# EasyEDA Pro project ProPrj_ESP32C3_UARTLogger_2025-09-07.epro, schematic Schematic2
Board Name: Board2; Create Date: 2025-08-16; Page Name: P1; Project Name: ESP32C3_UARTLogger; Schematic Name: Schematic2; Update Date: 2025-08-24; Company: 嘉立创EDA; Page Size: A4; Version: V1.0
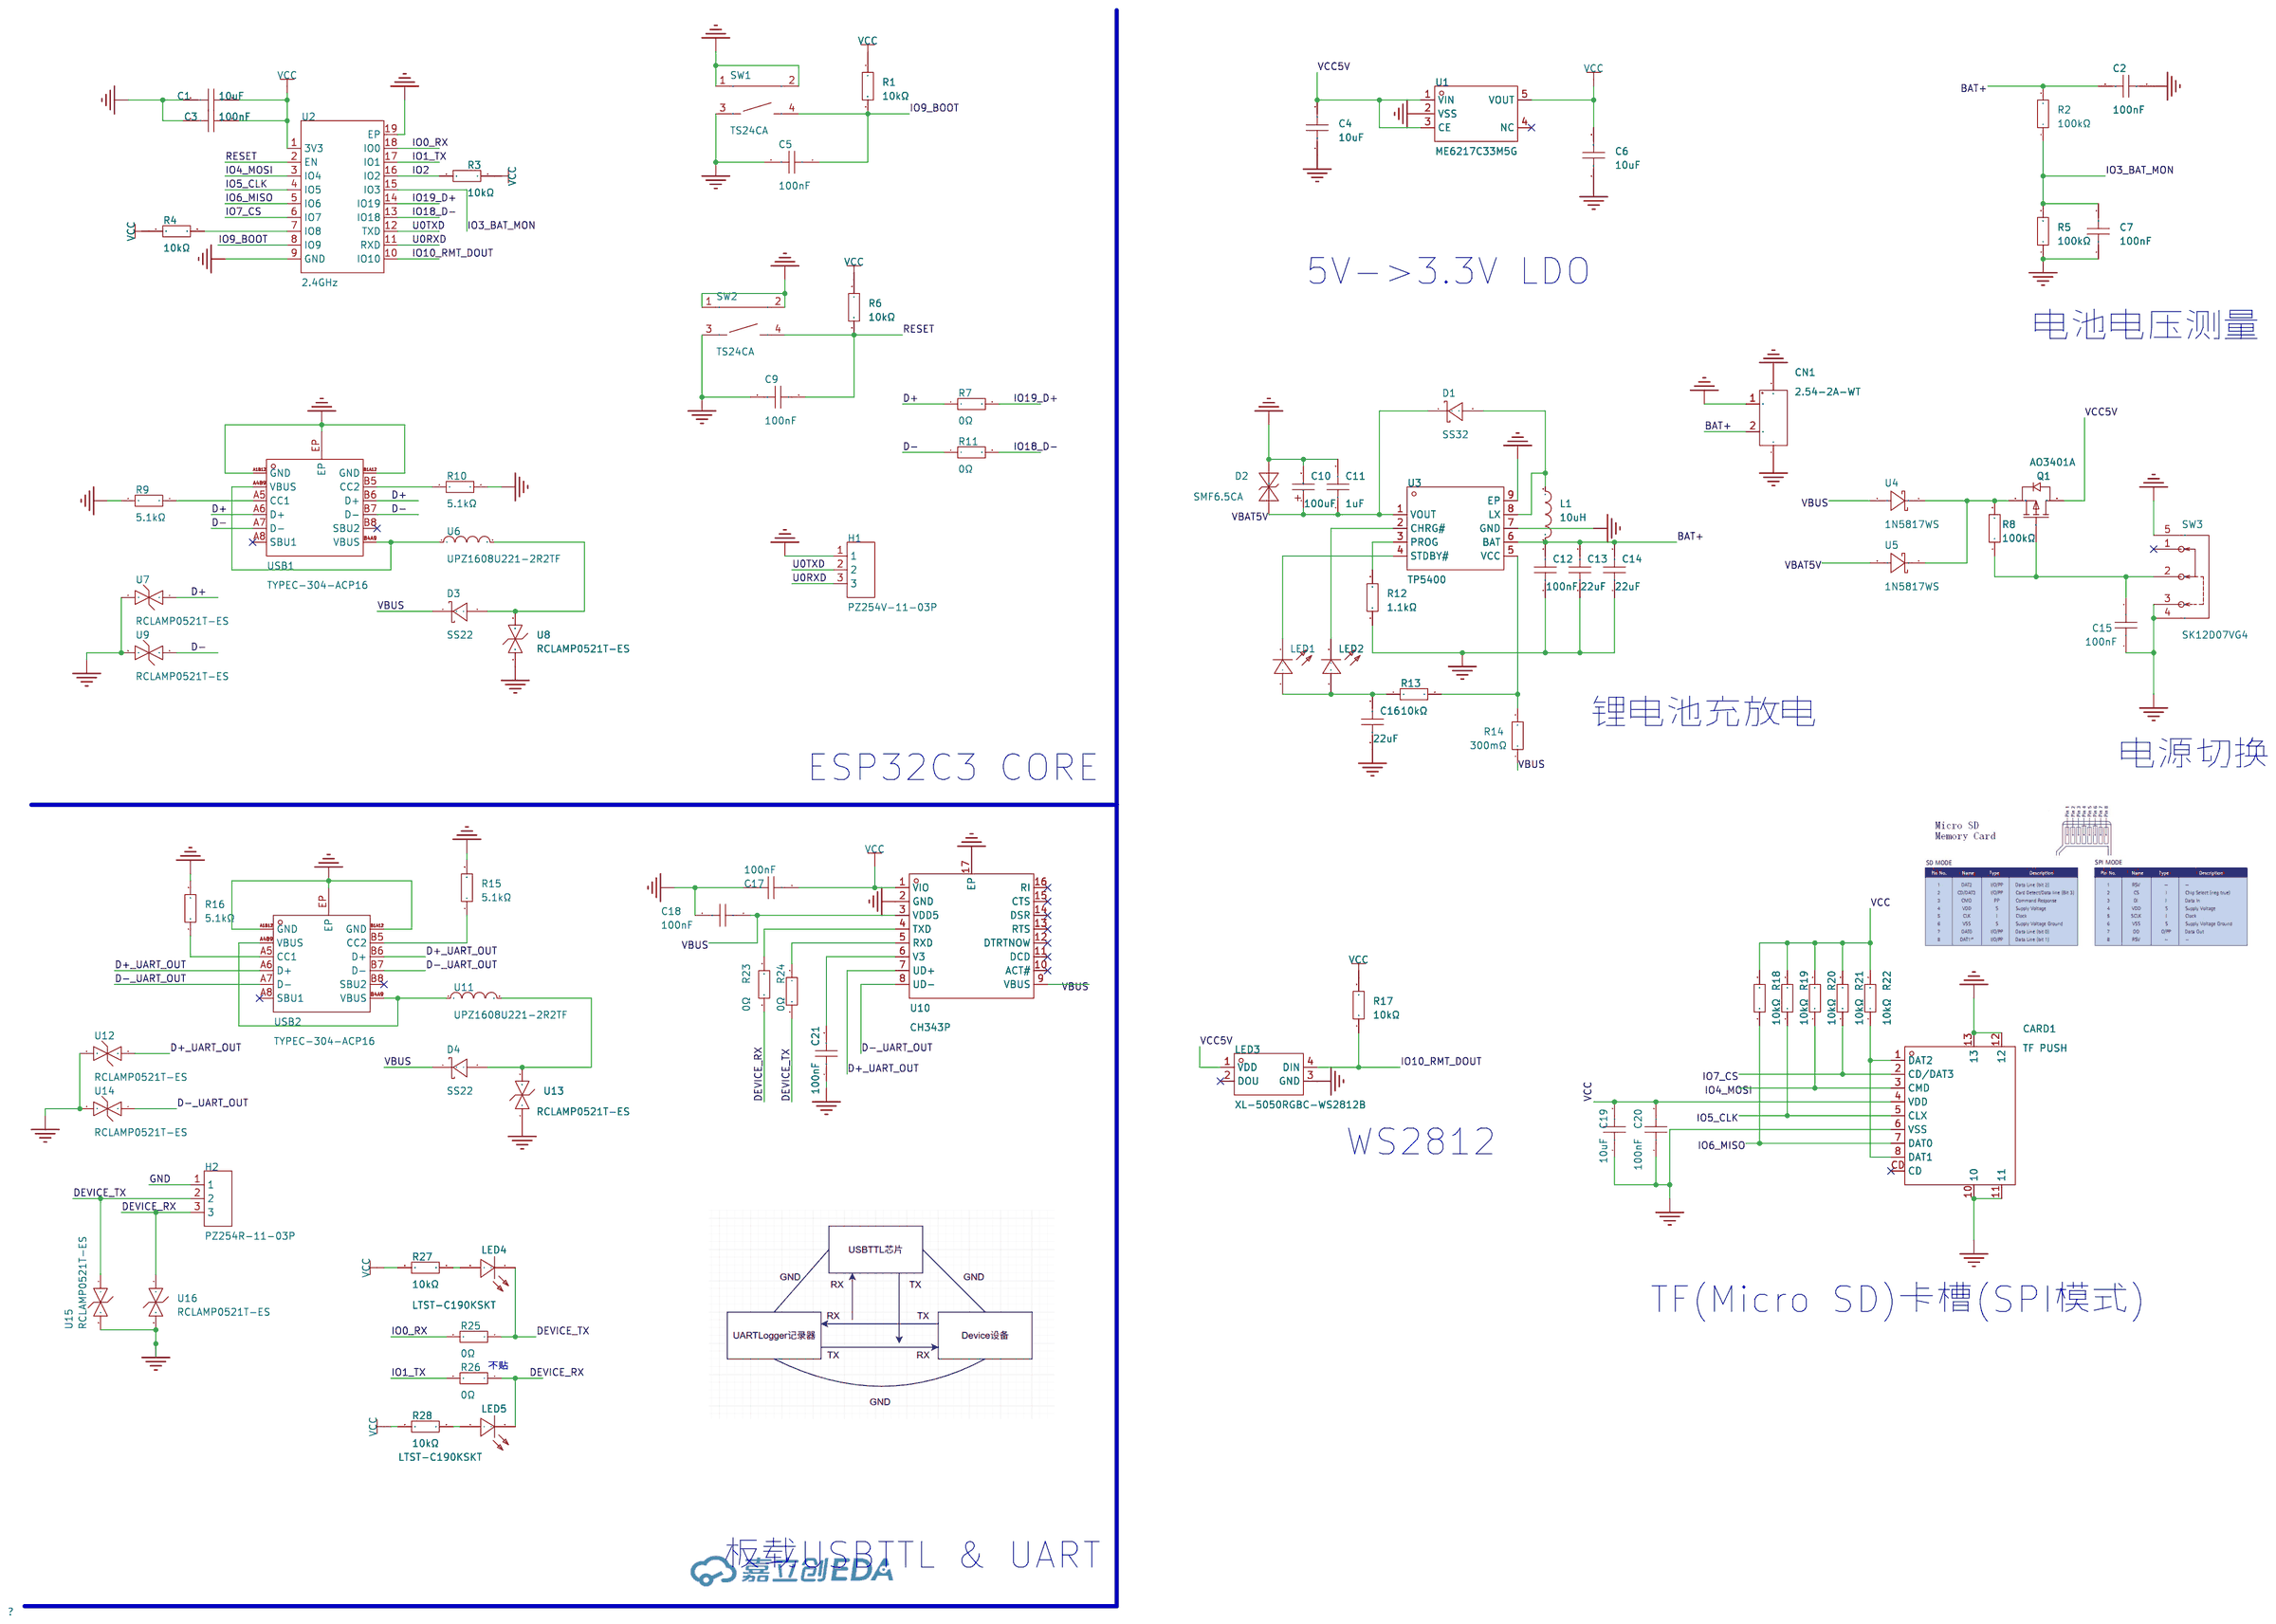
[diagram p1: schematic sheet]

## Parts
C1  10uF  [C0603]
C2  100nF  [C0603]
C3  100nF  [C0603]
C4  10uF  [C0603]
C5  100nF  [C0603]
C6  10uF  [C0603]
C7  100nF  [C0603]
C9  100nF  [C0603]
C10  100uF  [CASE-B_3528]
C11  1uF  [C0603]
C12  100nF  [C0603]
C13  22uF  [C0603]
C14  22uF  [C0603]
C15  100nF  [C0603]
C16  22uF  [C0603]
C17  100nF  [C0603]
C18  100nF  [C0603]
C19  10uF  [C0603]
C20  100nF  [C0603]
C21  100nF  [C0603]
CARD1  TF PUSH  [TF-SMD_TF-PUSH]
CN1  2.54-2A-WT  [CONN-SMD_2.54-2A-WT]
D1  SS32  [SMA_L4.3-W2.6-LS5.2-RD]
D2  SMF6.5CA  [SOD-123FL_L2.7-W1.8-LS3.8-BI]
D3  SS22  [SMA_L4.3-W2.6-LS5.2-RD]
D4  SS22  [SMA_L4.3-W2.6-LS5.2-RD]
H1  PZ254V-11-03P  [HDR-TH_3P-P2.54-V-M]
H2  PZ254R-11-03P  [HDR-TH_3P-P2.54-H-M-W10.4]
L1  10uH  [IND-SMD_L4.4-W4.2]
LED1  MHT192UGCT  [LED0603-RD_GREEN]
LED2  MHT192WDT-ICE  [LED0603-RD]
LED3  XL-5050RGBC-WS2812B  [LED-SMD_4P-L5.0-W5.0-BL_XL-5050RGBC]
LED4  LTST-C190KSKT  [LED0603-RD]
LED5  LTST-C190KSKT  [LED0603-RD]
Q1  AO3401A  [SOT-23_L2.9-W1.3-P1.90-LS2.4-BR]
R1  10kΩ  [R0603]
R2  100kΩ  [R0603]
R3  10kΩ  [R0603]
R4  10kΩ  [R0603]
R5  100kΩ  [R0603]
R6  10kΩ  [R0603]
R7  0Ω  [R0603]
R8  100kΩ  [R0603]
R9  5.1kΩ  [R0603]
R10  5.1kΩ  [R0603]
R11  0Ω  [R0603]
R12  1.1kΩ  [R0603]
R13  10kΩ  [R0603]
R14  300mΩ  [R0603]
R15  5.1kΩ  [R0603]
R16  5.1kΩ  [R0603]
R17  10kΩ  [R0603]
R18  10kΩ  [R0603]
R19  10kΩ  [R0603]
R20  10kΩ  [R0603]
R21  10kΩ  [R0603]
R22  10kΩ  [R0603]
R23  0Ω  [R0603]
R24  0Ω  [R0603]
R25  0Ω  [R0603]
R26  0Ω  [R0603]
R27  10kΩ  [R0603]
R28  10kΩ  [R0603]
SW1  TS24CA  [SW-SMD_TS24CA]
SW2  TS24CA  [SW-SMD_TS24CA]
SW3  SK12D07VG4  [SW-TH_SK12D07VG4]
U1  ME6217C33M5G  [SOT-23-5_L3.0-W1.7-P0.95-LS2.8-BR]
U2  2.4GHz  [BULETM-SMD_ESPRESSIF_ESP32-C3-WROOM-02-N4-4MB]
U3  TP5400  [ESOP-8_L4.9-W3.9-P1.27-LS6.0-BL-EP]
U4  1N5817WS  [SOD-323_L1.7-W1.3-LS2.6-RD-1]
U5  1N5817WS  [SOD-323_L1.7-W1.3-LS2.6-RD-1]
U6  UPZ1608U221-2R2TF  [L0603]
U7  RCLAMP0521T-ES  [DFN1006-2L-BI]
U8  RCLAMP0521T-ES  [DFN1006-2L-BI]
U9  RCLAMP0521T-ES  [DFN1006-2L-BI]
U10  CH343P  [TQFN-16_L3.0-W3.0-P0.50-BL-EP1.7]
U11  UPZ1608U221-2R2TF  [L0603]
U12  RCLAMP0521T-ES  [DFN1006-2L-BI]
U13  RCLAMP0521T-ES  [DFN1006-2L-BI]
U14  RCLAMP0521T-ES  [DFN1006-2L-BI]
U15  RCLAMP0521T-ES  [DFN1006-2L-BI]
U16  RCLAMP0521T-ES  [DFN1006-2L-BI]
USB1  TYPEC-304-ACP16  [USB-C-SMD_TYPE-C-16P-1]
USB2  TYPEC-304-ACP16  [USB-C-SMD_TYPE-C-16P-1]

## Library data of the parts
C1 C4 C6 C19 = CL10A106KP8NNNC: 容值:10uF;精度:±10%;额定电压:10V;材质(温度系数):X5R;; LCSC Part Name: 10uF ±10% 10V; Supplier Part: C19702; Manufacturer: SAMSUNG(三星); Supplier Footprint: 0603; JLCPCB Part Class: 基础库; Datasheet: https://atta.szlcsc.com/upload/public/pdf/source/20160103/1457707703378.pdf; Supplier: LCSC; Tolerance: ±10%; Voltage Rated: 10V; Temperature Coefficient: X5R; Check: true
C2 C7 = CC0603KRX7R9BB104: 容值:100nF;精度:±10%;额定电压:50V;温度系数:X7R;; LCSC Part Name: 100nF ±10% 50V; Supplier Part: C14663; Manufacturer: YAGEO(国巨); Supplier Footprint: 0603; JLCPCB Part Class: Basic Part; Datasheet: https://atta.szlcsc.com/upload/public/pdf/source/20180910/C282072_33301C7F631E79921B82A8DAC6BCC5B3.pdf; Supplier: LCSC; Tolerance: ±10%; Voltage Rated: 50V; Temperature Coefficient: X7R; Voltage Rating: 50V; Check: true
C3 C5 C9 C12 C15 C17 C18 C20 C21 = CC0603KRX7R9BB104: 容值:100nF;精度:±10%;额定电压:50V;材质(温度系数):X7R;; LCSC Part Name: 100nF ±10% 50V; Supplier Part: C14663; Manufacturer: YAGEO(国巨); Supplier Footprint: 0603; JLCPCB Part Class: Basic Part; Datasheet: https://atta.szlcsc.com/upload/public/pdf/source/20180910/C282072_33301C7F631E79921B82A8DAC6BCC5B3.pdf; Supplier: LCSC; Tolerance: ±10%; Voltage Rated: 50V; Temperature Coefficient: X7R; Check: true
C10 = TAJB107M010RNJ: 容值:100uF;精度:±20%;额定电压:10V;等效串联电阻:1.4Ω@100kHz;; LCSC Part Name: 100uF ±20% 10V; Supplier Part: C7196; Manufacturer: Kyocera AVX; Supplier Footprint: CASE-B-3528; JLCPCB Part Class: 扩展库; Datasheet: https://atta.szlcsc.com/upload/public/pdf/source/20160107/1457707750344.pdf; Supplier: LCSC; Tolerance: ±20%; Rated Voltage: 10V; Equivalent Series Resistance(ESR): 1.4Ω@100kHz; Operating Temperature: -55℃~+125℃; Check: true
C11 = CL10A105KB8NNNC: 容值:1uF;精度:±10%;额定电压:50V;材质(温度系数):X5R;; LCSC Part Name: 1uF ±10% 50V; Supplier Part: C15849; Manufacturer: SAMSUNG(三星); Supplier Footprint: 0603; JLCPCB Part Class: 基础库; Datasheet: https://atta.szlcsc.com/upload/public/pdf/source/20160218/1457707763339.pdf; Supplier: LCSC; Tolerance: ±10%; Voltage Rated: 50V; Temperature Coefficient: X5R; Check: true
C13 C14 C16 = CL10A226MQ8NRNC: 容值:22uF;精度:±20%;额定电压:6.3V;材质(温度系数):X5R;; LCSC Part Name: 22uF ±20% 6.3V; Supplier Part: C59461; Manufacturer: SAMSUNG(三星); Supplier Footprint: 0603; JLCPCB Part Class: Basic Part; Datasheet: https://atta.szlcsc.com/upload/public/pdf/source/20160218/1457707763339.pdf; Supplier: LCSC; Tolerance: ±20%; Voltage Rated: 6.3V; Temperature Coefficient: X5R; Check: true
CARD1 = TF PUSH: 卡连接方式:自弹式;卡类型:MicroSD卡(TF卡);连接器类型:卡座;本体最大高度:2mm;工作温度范围:-20℃~+90℃;; LCSC Part Name: 自弹式 MicroSD卡(TF卡) 卡座; Supplier Part: C393941; Manufacturer: SHOU HAN(首韩); Supplier Footprint: SMD; JLCPCB Part Class: 扩展库; Datasheet: https://atta.szlcsc.com/upload/public/pdf/source/20191011/C393941_0DDD896EE907FEB750D8B7B8982E2A67.pdf; Supplier: LCSC; Card Connection Mode: 自弹式; Card Type: MicroSD卡(TF卡); Connector Type: 卡座; Additional Card Detection Pins: 无; Maximum Body Height: 2mm; Operating Temperature Range: -20℃~+90℃; Check: true
CN1 = 2.54-2A-WT: 插针结构:1x2P;间距:2.54mm;安装方式:卧贴;参考系列:XH;总PIN数:2P;排数:1;每排PIN数:2;行距:-;额定电流:500mA;工作温度范围:-25℃~+85℃;; LCSC Part Name: 1x2P 间距:2.54mm 卧贴 系列:XH; Supplier Part: C722696; Manufacturer: CAX(创都); Supplier Footprint: SMD,P=2.54mm,卧贴; JLCPCB Part Class: 扩展库; Datasheet: https://atta.szlcsc.com/upload/public/pdf/source/20200831/C722696_77A3476FAF7CFEE79ECA533977340414.pdf; Supplier: LCSC; Pins Structure: 1x2P; Pitch: 2.54mm; Mounting Style: 卧贴; Reference Series: XH; Number of Pins: 2P; Number of Rows: 1; Number of PINs Per Row: 2; Current Rating (Max): 500mA; Operating Temperature Range: -25℃~+85℃; Check: true
D1 = SS32_C34897: 二极管配置:独立式;正向压降(Vf):550mV@3A;直流反向耐压(Vr):20V;整流电流:3A;; LCSC Part Name: 电压:20V 电流:3A; Supplier Part: C34897; Manufacturer: MDD(辰达半导体); Supplier Footprint: SMA(DO-214AC); JLCPCB Part Class: 扩展库; Datasheet: https://atta.szlcsc.com/upload/public/pdf/source/20230314/A80AE34493C69B89E2F4B1712F433538.pdf; Supplier: LCSC; Diode Configuration: 独立式; Forward Voltage (Vf@If): 550mV@3A; Reverse Voltage (Vr): 20V; Rectified Current: 3A; Reverse Leakage Current (Ir): 500uA@20V; Check: true
D2 = SMF6.5CA_C19077501: 极性:双向;反向截止电压(Vrwm):6.5V;最大钳位电压:11.2V;峰值脉冲电流(Ipp):17.9A;峰值脉冲功率(Ppp):200W;击穿电压:7.22V;; Supplier Part: C19077501; Manufacturer: 宏迦橙; Supplier Footprint: SOD-123FL; JLCPCB Part Class: 扩展库; Datasheet: https://atta.szlcsc.com/upload/public/pdf/source/20241029/BBF9A11676F655A5C9D4546A153AB943.pdf; Supplier: LCSC; polarity: 双向; Reverse Stand-Off Voltage (Vrwm): 6.5V; Maximum Clamping Voltage: 11.2V; Peak Pulse Current (Ipp): 17.9A; Peak Pulse Power Dissipation (Ppp): 200W; Breakdown Voltage: 7.22V; Reverse Leakage Current (Ir): 1uA; Number of Lines: 单路; Operating Temperature: -55℃~+155℃; Type: TVS; Check: true
D3 D4 = SS22_C64989: 二极管配置:独立式;正向压降(Vf):550mV@2A;直流反向耐压(Vr):20V;整流电流:2A;; LCSC Part Name: 电压:20V 电流:2A; Supplier Part: C64989; Manufacturer: MDD(辰达半导体); Supplier Footprint: SMA(DO-214AC); JLCPCB Part Class: 扩展库; Datasheet: https://atta.szlcsc.com/upload/public/pdf/source/20241121/6CE8804B7C48BAEAE01B59A44537D8A1.pdf; Supplier: LCSC; Diode Configuration: 独立式; Forward Voltage (Vf@If): 550mV@2A; Reverse Voltage (Vr): 20V; Rectified Current: 2A; Reverse Leakage Current (Ir): 500uA@20V; Check: true
H1 = PZ254V-11-03P: 插针结构:1x3P;间距:2.54mm;行距:-;圆针/方针:方针;安装方式:直插;排数:单排;总PIN位数:3P;额定电流:3A;额定电压:250V;配合针长度:6mm;塑高:2.5mm;端接针长度:3mm;工作温度:-40℃~+105℃;颜色:黑色;; LCSC Part Name: 1x3P 间距:2.54mm 方针 直插; Supplier Part: C2937625; Manufacturer: XFCN(兴飞); Supplier Footprint: 插件,P=2.54mm; JLCPCB Part Class: 扩展库; Datasheet: https://atta.szlcsc.com/upload/public/pdf/source/20200309/C492402_8335C3D49C4E4C618838D59BB1D024C1.pdf; Supplier: LCSC; Pin Structure: 1x3P; Pitch: 2.54mm; Circluar Pins/Square Pins: 方针; Mounting Type: 直插; Number of Rows: 单排; Number of Pins: 3P; Current Rating: 3A; Voltage Rating (Max): 250V; Length of Mating Pin: 6mm; Insulation Height: 2.5mm; Length of End Connection Pin: 3mm; Operating Temperature: -40℃~+105℃; Color: 黑色
H2 = PZ254R-11-03P: 插针结构:1x3P;间距:2.54mm;行距:-;圆针/方针:方针;安装方式:弯插;排数:单排;总PIN位数:3P;额定电流:-;额定电压:-;配合针长度:6mm;塑高:2.5mm;触头材质:黄铜;触头镀层:-;工作温度:-40℃~+105℃;颜色:黑色;; LCSC Part Name: 1x3P 间距:2.54mm 方针 弯插; Supplier Part: C492411; Manufacturer: XFCN(兴飞); Supplier Footprint: 弯插,P=2.54mm; JLCPCB Part Class: 扩展库; Datasheet: https://atta.szlcsc.com/upload/public/pdf/source/20200309/C492411_5256E8AAA7569F6D33B6ADBFAE4F2888.pdf; Supplier: LCSC; Pin Structure: 1x3P; Pitch: 2.54mm; Circluar Pins/Square Pins: 方针; Mounting Type: 弯插; Number of Rows: 单排; Number of Pins: 3P; Length of Mating Pin: 6mm; Insulation Height: 2.5mm; Contact Material: 黄铜; Operating Temperature: -40℃~+105℃; Color: 黑色; Check: true
L1 = MWSA0402S-100MT: 电感值:10uH;精度:±20%;额定电流:1.6A;饱和电流(Isat):2A;类型:-;; LCSC Part Name: 10uH ±20% 2A; Supplier Part: C408339; Manufacturer: Sunlord(顺络); Supplier Footprint: SMD,4.4x4.2mm; JLCPCB Part Class: 扩展库; Datasheet: https://atta.szlcsc.com/upload/public/pdf/source/20231024/D9DB0CBBB5804BFBC9233D4A02F4216A.pdf; Supplier: LCSC; Tolerance: ±20%; Rated Current: 1.6A; Saturation Current (Isat): 2A; DC Resistance (DCR): 282mΩ; Check: true
LED1 = MHT192UGCT: 发光颜色:翠绿色;功率:60mW;正向电流:20mA;主波长:515nm~530nm;二极管配置:-;透镜颜色:无色透明透镜;色温:-;发光角度:120°;载带方式:-;工作温度:-40℃~+85℃;; LCSC Part Name: 翠绿; Supplier Part: C389519; Manufacturer: MEIHUA(美华); Supplier Footprint: 0603; JLCPCB Part Class: 扩展库; Datasheet: https://atta.szlcsc.com/upload/public/pdf/source/20190515/C389519_7BC27E831414348C8AF19AF18EE4BF58.pdf; Supplier: LCSC; Emitted Color: 翠绿色; Power Dissipation: 60mW; Forward Current: 20mA; Dominant Wavelength: 515nm~530nm; Peak Wavelength: 518nm; Lens Color: 无色透明透镜; Viewing Angle: 120°; Operating Temperature: -40℃~+85℃; Check: true
LED2 = MHT192WDT-ICE: 发光颜色:蓝灯;二极管配置:-;透镜颜色:雾状黄;主波长:-;峰值波长:-;色温:-;光通量(25℃时):-;测试电流:5mA;正向电压(VF):3.1V;发光强度:1420mcd;功率:95mW;发光角度:130°;安装方式:-;工作温度:-35℃~+85℃;; LCSC Part Name: 0603正贴冰蓝色光0.6T 冰蓝; Supplier Part: C389522; Manufacturer: MEIHUA(美华); Supplier Footprint: 0603; JLCPCB Part Class: 扩展库; Datasheet: https://atta.szlcsc.com/upload/public/pdf/source/20190515/C389522_27B43B3FF0A26A72E674F8300763D196.pdf; Supplier: LCSC; Emitted Color: 蓝灯; Lens Color: 雾状黄; Forward Current: 5mA; Forward Voltage (VF): 3.1V; Luminous Intensity: 1420mcd; Power Dissipation: 95mW; Viewing Angle: 130°; Operating Temperature: -35℃~+85℃; Check: true
LED3 = XL-5050RGBC-WS2812B: 5050七彩幻彩透明贴片LED灯珠 5050 幻彩透明四脚 ws2812B 内置驱动IC; Supplier Part: C2843785; Manufacturer: XINGLIGHT(成兴光); Supplier Footprint: SMD5050; JLCPCB Part Class: 扩展库; Datasheet: https://atta.szlcsc.com/upload/public/pdf/source/20240412/E1004CAA80592E31D08BFE019083806F.pdf; Supplier: LCSC; Check: true
LED4 LED5 = LTST-C190KSKT: 发光颜色:黄色;正向电压(VF):2.1V;功率:75mW;正向电流:20mA;主波长:584.5nm~597nm;二极管配置:-;透镜颜色:无色透明透镜;色温:-;发光强度:104mcd;发光角度:130°;载带方式:-;工作温度:-30℃~+85℃;; LCSC Part Name: 黄灯; Supplier Part: C125095; Manufacturer: LITEON(光宝); Supplier Footprint: 0603; JLCPCB Part Class: 扩展库; Datasheet: https://atta.szlcsc.com/upload/public/pdf/source/20180129/C125095_15171881843821315881.pdf; Supplier: LCSC; Emitted Color: 黄色; Forward Voltage (VF): 2.1V; Power Dissipation: 75mW; Forward Current: 20mA; Dominant Wavelength: 584.5nm~597nm; Peak Wavelength: 588nm; Lens Color: 无色透明透镜; Luminous Intensity: 104mcd; Viewing Angle: 130°; Operating Temperature: -30℃~+85℃
Q1 = AO3401A_C347476: 类型:1个P沟道;漏源电压(Vdss):30V;连续漏极电流(Id):4.2A;导通电阻(RDS(on)@Vgs,Id):50mΩ@10V;功率(Pd):1.4W;阈值电压(Vgs(th)@Id):400mV@250uA;; LCSC Part Name: 1个P沟道 耐压:30V 电流:4.2A; Supplier Part: C347476; Manufacturer: UMW(友台半导体); Supplier Footprint: SOT-23; JLCPCB Part Class: Extended Part; Datasheet: https://atta.szlcsc.com/upload/public/pdf/source/20231109/42F312EBB081D72F04A7E8221BFFAF9D.pdf; Supplier: LCSC; Type: 1个P沟道; Drain Source Voltage (Vdss): 30V; Continuous Drain Current (Id): 4.2A; Drain Source On Resistance (RDS(on)@Vgs,Id): 50mΩ@10V; Power Dissipation (Pd): 1.4W; Gate Threshold Voltage (Vgs(th)@Id): 400mV@250uA; Total Gate Charge (Qg@Vgs): 9.4nC@4.5V; Input Capacitance (Ciss@Vds): 954pF; Reverse Transfer Capacitance (Crss@Vds): 77pF; Operating Temperature: -55℃~+150℃; Check: true
R1 R3 R4 R6 R13 R17 R27 R28 = 0603WAF1002T5E: 电阻类型:厚膜电阻;阻值:10kΩ;精度:±1%;功率:100mW;最大工作电压:75V;温度系数:±100ppm/℃;; LCSC Part Name: 厚膜电阻 10kΩ ±1% 100mW; Supplier Part: C25804; Manufacturer: UNI-ROYAL(厚声); Supplier Footprint: 0603; JLCPCB Part Class: Basic Part; Datasheet: https://atta.szlcsc.com/upload/public/pdf/source/20200306/C422600_1E6D84923E4A46A82E41ADD87F860B5C.pdf; Supplier: LCSC; Type: 厚膜电阻; Tolerance: ±1%; Power(Watts): 100mW; Overload Voltage (Max): 75V; Temperature Coefficient: ±100ppm/℃; Operating Temperature Range: -55℃~+155℃; Check: true
R2 R5 R8 = 0603WAF1003T5E: 电阻类型:厚膜电阻;阻值:100kΩ;精度:±1%;功率:100mW;最大工作电压:75V;温度系数:±100ppm/℃;; LCSC Part Name: 100kΩ ±1% 100mW 厚膜电阻; Supplier Part: C25803; Manufacturer: UNI-ROYAL(厚声); Supplier Footprint: 0603; JLCPCB Part Class: 基础库; Datasheet: https://atta.szlcsc.com/upload/public/pdf/source/20200306/C422600_1E6D84923E4A46A82E41ADD87F860B5C.pdf; Supplier: LCSC; Type: 厚膜电阻; Tolerance: ±1%; Power(Watts): 100mW; Overload Voltage (Max): 75V; Temperature Coefficient: ±100ppm/℃; Operating Temperature Range: -55℃~+155℃; Check: true
R7 R11 R23-R26 = 0603WAF0000T5E: 电阻类型:厚膜电阻;阻值:0Ω;精度:±1%;功率:100mW;工作电压:75V;; LCSC Part Name: 0Ω ±1% 100mW 厚膜电阻; Supplier Part: C21189; Manufacturer: UNI-ROYAL(厚声); Supplier Footprint: 0603; JLCPCB Part Class: Basic Part; Datasheet: https://item.szlcsc.com/datasheet/0603WAF0000T5E/21903.html; Supplier: LCSC; Type: 厚膜电阻; Tolerance: ±1%; Power(Watts): 100mW; Voltage-Supply(Max): 75V; Operating Temperature: -55℃~+155℃
R9 R10 R15 R16 = 0603WAF5101T5E: 电阻类型:厚膜电阻;阻值:5.1kΩ;精度:±1%;功率:100mW;最大工作电压:75V;温度系数:±100ppm/℃;; LCSC Part Name: 5.1kΩ ±1% 100mW 厚膜电阻; Supplier Part: C23186; Manufacturer: UNI-ROYAL(厚声); Supplier Footprint: 0603; JLCPCB Part Class: Basic Part; Datasheet: https://atta.szlcsc.com/upload/public/pdf/source/20200306/C422600_1E6D84923E4A46A82E41ADD87F860B5C.pdf; Supplier: LCSC; Type: 厚膜电阻; Tolerance: ±1%; Power(Watts): 100mW; Overload Voltage (Max): 75V; Temperature Coefficient: ±100ppm/℃; Operating Temperature Range: -55℃~+155℃; Check: true
R12 = 0603WAF1101T5E: 电阻类型:厚膜电阻;阻值:1.1kΩ;精度:±1%;功率:100mW;工作电压:75V;温度系数:±100ppm/℃;; LCSC Part Name: 1.1kΩ ±1% 100mW 厚膜电阻; Supplier Part: C22764; Manufacturer: UNI-ROYAL(厚声); Supplier Footprint: 0603; JLCPCB Part Class: 扩展库; Datasheet: https://atta.szlcsc.com/upload/public/pdf/source/20200306/C422600_1E6D84923E4A46A82E41ADD87F860B5C.pdf; Supplier: LCSC; Type: 厚膜电阻; Tolerance: ±1%; Power(Watts): 100mW; Voltage-Supply(Max): 75V; Temperature Coefficient: ±100ppm/℃; Operating Temperature: -55℃~+155℃; Check: true
R14 = 0603WAF300LT5E: 电阻类型:厚膜电阻;阻值:300mΩ;精度:±1%;功率:100mW;最大工作电压:75V;温度系数:±800ppm/℃;; LCSC Part Name: 300mΩ ±1% 100mW 厚膜电阻; Supplier Part: C247136; Manufacturer: UNI-ROYAL(厚声); Supplier Footprint: 0603; JLCPCB Part Class: Extended Part; Datasheet: https://atta.szlcsc.com/upload/public/pdf/source/20200306/C422600_1E6D84923E4A46A82E41ADD87F860B5C.pdf; Supplier: LCSC; Type: 厚膜电阻; Tolerance: ±1%; Power(Watts): 100mW; Overload Voltage (Max): 75V; Temperature Coefficient: ±800ppm/℃; Operating Temperature Range: -55℃~+155℃; Check: true
R18-R22 = RC0603FR-0710KL: 电阻类型:厚膜电阻;阻值:10kΩ;精度:±1%;功率:100mW;最大工作电压:75V;温度系数:±100ppm/℃;; LCSC Part Name: 厚膜电阻 10kΩ ±1% 100mW; Supplier Part: C98220; Manufacturer: YAGEO(国巨); Supplier Footprint: 0603; JLCPCB Part Class: 扩展库; Datasheet: https://atta.szlcsc.com/upload/public/pdf/source/20180927/C295883_E8D83085EA81BD7DE0B2B681138C15EE.pdf; Supplier: LCSC; Type: 厚膜电阻; Tolerance: ±1%; Power(Watts): 100mW; Overload Voltage (Max): 75V; Temperature Coefficient: ±100ppm/℃; Operating Temperature Range: -55℃~+155℃; Check: true
SW1 SW2 = TS24CA: 电路结构:单刀单掷;按钮形状:矩形按钮;安装方式:卧贴;开关长度:4.55mm;开关宽度:1.8mm;开关高度:3.5mm;触点电流:50mA;额定电压:12V;带灯:-;工作寿命:-;; LCSC Part Name: 4.55*1.8*3.5mm 卧贴 轻触开关; Supplier Part: C393942; Manufacturer: SHOU HAN(首韩); Supplier Footprint: SMD; JLCPCB Part Class: 扩展库; Datasheet: https://atta.szlcsc.com/upload/public/pdf/source/20240424/43D93777DD1504A9F6E2A772ABCDC7B4.pdf; Supplier: LCSC; Circuit: 单刀单掷; Actuator Style: 矩形按钮; Mounting Type: 卧贴; Length: 4.55mm; Width: 1.8mm; Switch Height: 3.5mm; Contact Current: 50mA; Voltage Rating: 12V; Check: true
SW3 = SK12D07VG4: 电路结构:单刀双掷;安装方式:-;额定电流(DC):500mA;额定电压(DC):50V;额定电流(AC):-;额定电压(AC):-;机械寿命:5千次;; LCSC Part Name: 3脚2档位 卧插 滑动开关; Supplier Part: C393937; Manufacturer: SHOU HAN(首韩); Supplier Footprint: 插件; JLCPCB Part Class: 扩展库; Datasheet: https://atta.szlcsc.com/upload/public/pdf/source/20190521/C393937_939FE26E571CC67D2D532E953108A1B0.pdf; Supplier: LCSC; Circuit: 单刀双掷; Actuator Style: 矩形柱状; Pin Style: PC引脚; Switch Height: 8.8mm; Current Rating (DC): 500mA; Voltage Rating (DC): 50V; Mechanical Life: 5千次; Check: true
U1 = ME6217C33M5G: 输出类型:固定;最大输入电压:7V;输出电压:3.3V;最大输出电流:800mA;电源纹波抑制比(PSRR):65dB@(1kHz);输出极性:正极;; LCSC Part Name: 输入7V 输出3.3V 800mA; Supplier Part: C427602; Manufacturer: MICRONE(南京微盟); Supplier Footprint: SOT-23-5; JLCPCB Part Class: 扩展库; Datasheet: https://atta.szlcsc.com/upload/public/pdf/source/20190910/C427602_D4B9162A2E9D9EF57C60010DFDECEF37.pdf; Supplier: LCSC; Output Type: 固定; Maximum Input Voltage: 7V; Output Voltage: 3.3V; MAX Output Current: 800mA; Power Supply Rejection Ratio (PSRR): 65dB@(1kHz); Dropout Voltage: 180mV@(300mA); Output Polarity: 正极; Number of Outputs: 1; Check: true
U2 = ESP32-C3-WROOM-02-N4: 核心处理器:ESP32-C3芯片;频率:2.4GHz;发射功率:20.5dBm;; Supplier Part: C2934560; Manufacturer: ESPRESSIF(乐鑫); Supplier Footprint: VFQFN-32-EP; JLCPCB Part Class: 扩展库; Datasheet: https://atta.szlcsc.com/upload/public/pdf/source/20220106/F07459EFFE1D7CBA94B4FB8A075146A6.pdf; Supplier: LCSC; Core Processor: ESP32-C3芯片; Support Interface: I2C；GPIO；SPI；JTAG；UART；USB；I2S; Output Power: 20.5dBm; Check: true
U3 = TP5400: Supplier Part: C2891434; Manufacturer: TOPPOWER(南京拓微); Supplier Footprint: ESOP-8; JLCPCB Part Class: 扩展库; Datasheet: https://atta.szlcsc.com/upload/public/pdf/source/20210909/352D9D40D77A1DD73F7904E364EF004B.pdf; Supplier: LCSC; Check: true
U4 U5 = 1N5817WS_C5190152: 直流反向耐压(Vr):20V;整流电流:1A;; LCSC Part Name: 电压:20V 电流:1A; Supplier Part: C5190152; Manufacturer: Hottech(合科泰); Supplier Footprint: SOD-323; JLCPCB Part Class: 扩展库; Datasheet: https://atta.szlcsc.com/upload/public/pdf/source/20221011/0135DD526E6E216218CEB88C6A2F208C.pdf; Supplier: LCSC; Reverse Voltage (Vr): 20V; Rectified Current: 1A; Check: true
U6 U11 = UPZ1608U221-2R2TF: 标称阻抗@测试频率:220Ω@100MHz;误差:±25%;直流电阻(RDC):50mΩ;; LCSC Part Name: 单路 0603磁珠 阻抗220Ω@100MHz; Supplier Part: C279745; Manufacturer: Sunlord(顺络); Supplier Footprint: 0603; JLCPCB Part Class: 扩展库; Datasheet: https://atta.szlcsc.com/upload/public/pdf/source/20231030/6F67BDFA94A48EA93F9ABB358D1D978C.pdf; Supplier: LCSC; Impedance @ Frequency: 220Ω@100MHz; Tolerance: ±25%; DC Resistance: 50mΩ; Current Rating: 2.2A; Circuits: 1; Check: true
U7-U9 U12-U16 = RCLAMP0521T-ES: 极性:双向;反向截止电压(Vrwm):5V;最大钳位电压:18V;峰值脉冲电流(Ipp):4A;峰值脉冲功率(Ppp):80W;击穿电压:6V;; LCSC Part Name: 0521/0531，单路双向ESD静电防护器件，20kV，CJ：0.25pF；HDMI/USB/NFC/RF超高速接口通讯防护; Supplier Part: C5180263; Manufacturer: ElecSuper(静芯微); Supplier Footprint: DFN1006-2L; JLCPCB Part Class: 扩展库; Datasheet: https://atta.szlcsc.com/upload/public/pdf/source/20240905/E90AFA5EC59D44930BEC0D45A1143918.pdf; Supplier: LCSC; polarity: 双向; Reverse Stand-Off Voltage (Vrwm): 5V; Maximum Clamping Voltage: 18V; Peak Pulse Current (Ipp): 4A; Peak Pulse Power Dissipation (Ppp): 80W; Breakdown Voltage: 6V; Reverse Leakage Current (Ir): 1uA; Number of Lines: 单路; Type: ESD; Check: true
U10 = CH343P: 应用功能:-;接口协议:-;; Supplier Part: C2846043; Manufacturer: WCH(南京沁恒); Supplier Footprint: TQFN-16-EP(3x3); JLCPCB Part Class: 扩展库; Datasheet: https://atta.szlcsc.com/upload/public/pdf/source/20211010/C2846043_7FA705E1F14A2906F6A2AFA45FA28209.pdf; Supplier: LCSC; Check: true
USB1 USB2 = TYPEC-304-ACP16: 连接器类型:Type-C;标准:-;公母:母;端口数量:1;触点数量:16P;安装方式:卧贴;额定电流 - 电源:3A;触头材质:铜;触头镀层:金;工作温度范围:-40℃~+85℃;焊接温度(最大值):-;; LCSC Part Name: Type-C 母 卧贴; Supplier Part: C2982555; Manufacturer: XUNPU(讯普); Supplier Footprint: SMD; JLCPCB Part Class: 扩展库; Datasheet: https://atta.szlcsc.com/upload/public/pdf/source/20220311/3C907F75E12F45E4EE7F73565AB9C294.pdf; Supplier: LCSC; Connector Type: Type-C; Gender: 母; Number of Ports: 1; Number of Contacts: 16P; Mounting Style: 卧贴; Current Rating - Power (Max): 3A; Contact Material: 铜; Contact Plating: 金; Operating Temperature Range: -40℃~+85℃; Check: true

## Nets
GND: C1.1 C2.1 C3.1 C4.1 C5.2 C6.1 C7.1 C9.2 C10.2 C11.2 C12.1 C13.1 C14.1 C15.1 C16.1 C17.2 C18.2 C19.1 C20.1 C21.1 CARD1.6(VSS) CARD1.10 CARD1.11 CARD1.12 CARD1.13 CN1.1 CN1.3 CN1.4 D2.1 H1.1 H2.1 LED3.3(GND) R5.1 R9.2 R10.2 R12.1 R15.2 R16.2 SW1.1 SW1.2 SW1.3 SW2.1 SW2.2 SW2.3 SW3.3 SW3.4 SW3.5 U1.2(VSS) U2.9(GND) U2.19(EP) U3.7(GND) U3.9(EP) U7.2 U8.1 U9.2 U10.2(GND) U10.17(EP) U12.2 U13.1 U14.2 U15.2 U16.2 USB1.A1B12(GND) USB1.B1A12(GND) USB1.EP USB2.A1B12(GND) USB2.B1A12(GND) USB2.EP
VBAT5V: C10.1 C11.1 D1.1(K) D2.2 U3.1(VOUT) U5.2(A)
VBUS: C18.1 D3.1(K) D4.1(K) R14.1 U4.2(A) U10.3(VDD5) U10.9(VBUS)
VCC: C1.2 C3.2 C6.2 C17.1 C19.2 C20.2 CARD1.4(VDD) R1.1 R3.1 R4.1 R6.1 R17.2 R18.2 R19.2 R20.2 R21.2 R22.2 R27.1 R28.1 U1.5(VOUT) U2.1(3V3) U10.1(VIO)
VCC5V: C4.2 LED3.1(VDD) Q1.3(D) U1.1(VIN) U1.3(CE)
BAT+: C2.2 C12.2 C13.2 C14.2 CN1.2 L1.2 R2.2 U3.6(BAT)
D+: R7.1 U7.1 USB1.A6(D+) USB1.B6(D+)
D+_UART_OUT: U10.7(UD+) U12.1 USB2.A6(D+) USB2.B6(D+)
D-: R11.1 U9.1 USB1.A7(D-) USB1.B7(D-)
D-_UART_OUT: U10.8(UD-) U14.1 USB2.A7(D-) USB2.B7(D-)
DEVICE_RX: H2.3 LED5.1(-) R23.2 R26.1 U16.1
DEVICE_TX: H2.2 LED4.1(-) R24.2 R25.1 U15.1
IO0_RX: R25.2 U2.18(IO0)
IO1_TX: R26.2 U2.17(IO1)
IO2: R3.2 U2.16(IO2)
IO3_BAT_MON: C7.2 R2.1 R5.2 U2.15(IO3)
IO4_MOSI: CARD1.3(CMD) R20.1 U2.3(IO4)
IO5_CLK: CARD1.5(CLX) R19.1 U2.4(IO5)
IO6_MISO: CARD1.7(DAT0) R18.1 U2.5(IO6)
IO7_CS: CARD1.2(CD/DAT3) R21.1 U2.6(IO7)
IO9_BOOT: C5.1 R1.2 SW1.4 U2.8(IO9)
IO10_RMT_DOUT: LED3.4(DIN) R17.1 U2.10(IO10)
IO18_D-: R11.2 U2.13(IO18)
IO19_D+: R7.2 U2.14(IO19)
RESET: C9.1 R6.2 SW2.4 U2.2(EN)
U0RXD: H1.3 U2.11(RXD)
U0TXD: H1.2 U2.12(TXD)
$1N1037: R4.2 U2.7(IO8)
$1N2849: R10.1 USB1.B5(CC2)
$1N2855: U6.1 USB1.A4B9(VBUS) USB1.B4A9(VBUS)
$1N2861: R9.1 USB1.A5(CC1)
$1N3712: C21.2 U10.6(V3)
$1N4143: U11.1 USB2.A4B9(VBUS) USB2.B4A9(VBUS)
$1N4164: R16.1 USB2.A5(CC1)
$1N5573: R15.1 USB2.B5(CC2)
$1N5644: D4.2(A) U11.2 U13.2
$1N5686: D3.2(A) U6.2 U8.2
$1N9313: D1.2(A) L1.1 U3.8(LX)
$1N9314: R12.2 U3.3(PROG)
$1N9315: LED1.1(-) U3.4(STDBY#)
$1N9316: LED2.1(-) U3.2(CHRG#)
$1N9317: R13.2 R14.2 U3.5(VCC)
$1N9320: C16.2 LED1.2(+) LED2.2(+) R13.1
$1N9326: Q1.2(S) R8.2 U4.1(C) U5.1(C)
$1N9327: C15.2 Q1.1(G) R8.1 SW3.2
$1N15856: CARD1.1(DAT2) CARD1.8(DAT1) R22.1
$1N37074: R23.1 U10.4(TXD)
$1N37118: R24.1 U10.5(RXD)
$1N56887: LED4.2(+) R27.2
$1N56895: LED5.2(+) R28.2

Not connected (* = marked no-connect by the designer): CARD1 CD*; LED3 2(DOU)*; SW3 1*; U1 4(NC)*; U10 10(ACT#)* 11(DCD)* 12(DTRTNOW)* 13(RTS)* 14(DSR)* 15(CTS)* 16(RI)*; USB1 A8(SBU1)* B8(SBU2)*; USB2 A8(SBU1)* B8(SBU2)*

## Notes on the sheet
- 5V->3.3V LDO
- 电池电压测量
- 锂电池充放电
- 电源切换
- ESP32C3 CORE
- WS2812
- TF(Micro SD)卡槽(SPI模式)
- 不贴
- 板载USBTTL & UART
